# EAGLE schematic GPS (EAGLE 7.2.0)
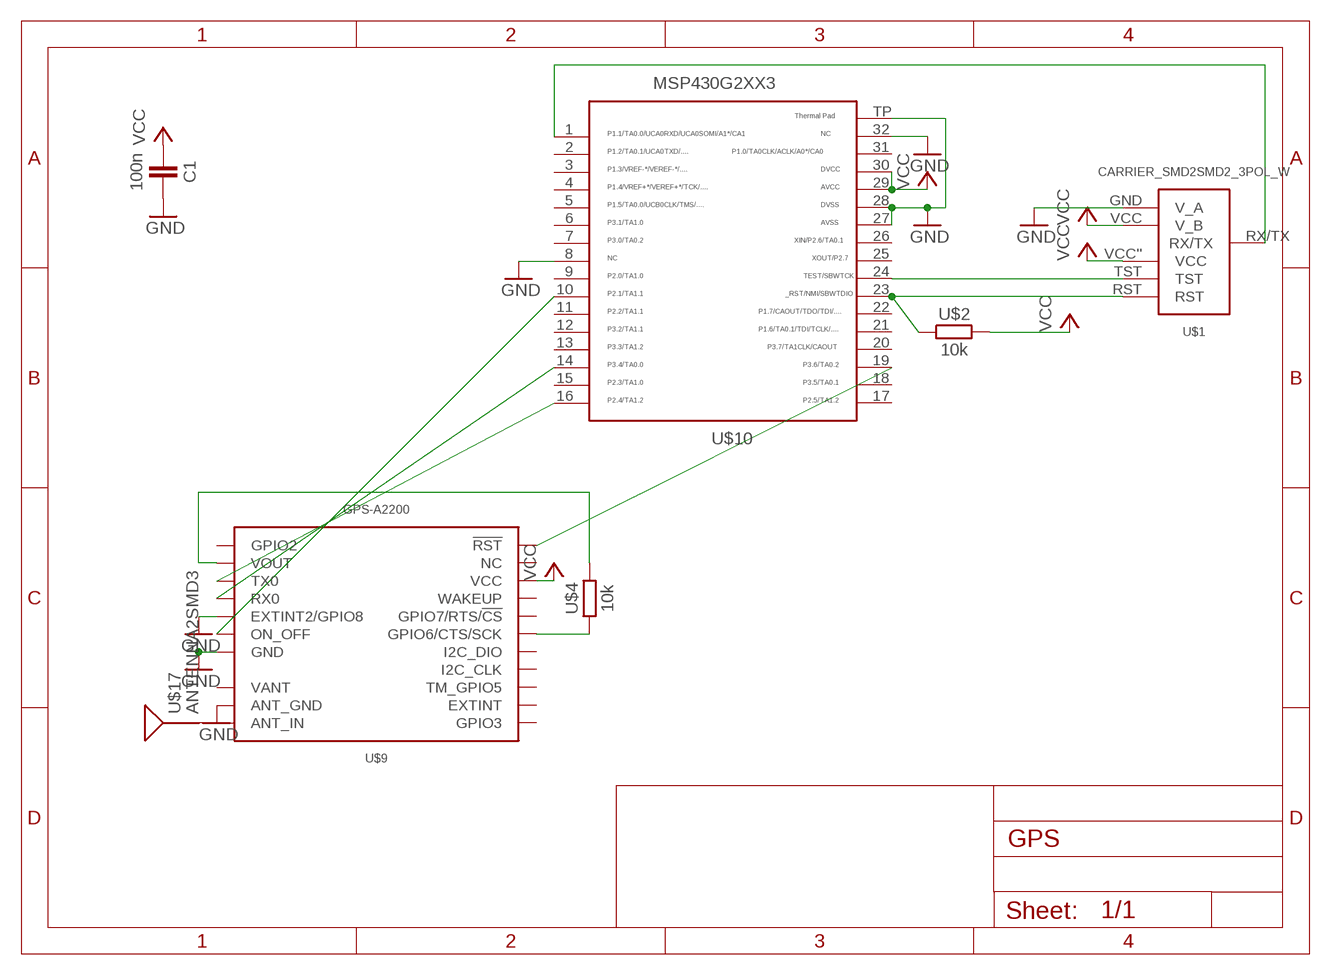
[diagram p0: schematic, sheet 1]

## Parts
C1  100n  CAPACITOR  [603]
U$1  CARRIER_SMD2SMD2_3POL_W  [CARRIER_SMD2_WIDE_3POL]
U$2  10k  RESISTOR0603  [603]
U$4  10k  RESISTOR0603  [603]
U$9  GPS-A2200  [A2200]
U$10  MSP430G2553  [QFN32]
U$17  ANTENNA2SMD3  [ANTENNA-CHIP4]

## Nets
GND: C1.2 U$1.GND(V_A) U$9.ANT_GND U$9.EXTINT2/GPIO8 U$9.GND@1(GND) U$9.GND@2(GND) U$9.GND@3(GND) U$9.GND@4(GND) U$9.GND@5(GND) U$9.GND@6(GND) U$9.GND@7(GND) U$9.GND@8(GND) U$9.GND@9(GND) U$9.GND@10(GND) U$9.GND@11(GND) U$10.8 U$10.27 U$10.28 U$10.32 U$10.TP
N$2: U$9.TX0 U$10.16
N$3: U$1.TST U$10.24
N$4: U$1.RST U$2.1 U$10.23
N$5: U$9.RX0 U$10.14
N$6: U$9.!RST U$10.19
N$7: U$9.ON_OFF U$10.10
N$12: U$1.RX/TX U$10.1
N$24: U$4.1 U$9.GPIO6(GPIO6/CTS/SCK)
N$25: U$4.2 U$9.VOUT
N$26: U$9.ANT_IN U$17.SIG(SIGNAL)
VCC: C1.1 U$1.VCC''(VCC) U$1.VCC(V_B) U$2.2 U$9.VCC U$10.29 U$10.30
Unconnected: U$9.EXTINT U$9.GPIO2 U$9.GPIO3 U$9.GPIO7(GPIO7/RTS/!CS) U$9.I2C_CLK U$9.I2C_DIO U$9.NC U$9.TM_GPIO5 U$9.VANT U$9.WAKEUP U$10.2 U$10.3 U$10.4 U$10.5 U$10.6 U$10.7 U$10.9 U$10.11 U$10.12 U$10.13 U$10.15 U$10.17 U$10.18 U$10.20 U$10.21 U$10.22 U$10.25 U$10.26 U$10.31

## Library data of the parts
C1 = thar:CAPACITOR
U$1 = thar:CARRIER_SMD2
U$2 U$4 = thar:RESISTOR
U$9 = thar:GPS-A2200: MAESTRO WIRELESS SOLUTIONS - A2200A - GPS-MODUL, ROM-BASIERT, MINI OUTLINE Farnell Best.Nr.: 2281694 Herst.Bez.: A2200A
U$10 = thar:MSP430G2553: TEXAS INSTRUMENTS MSP430G2553IRHB32R MCU, 16BIT, MSP430, 16MHZ, QFN-32 Farnell Best.Nr.: 2325726 Herst.Bez.: MSP430G2553IRHB32R
U$17 = SparkFun-RF:ANTENNA2: Chip antenna Single endded antenna. Common with smaller chip antennas. CHIP4 package is the GPS Chip Antenna SKU: GPS-08418. CHIP5 package is 2.4GHz chip antenna SKU: WRL-00144.